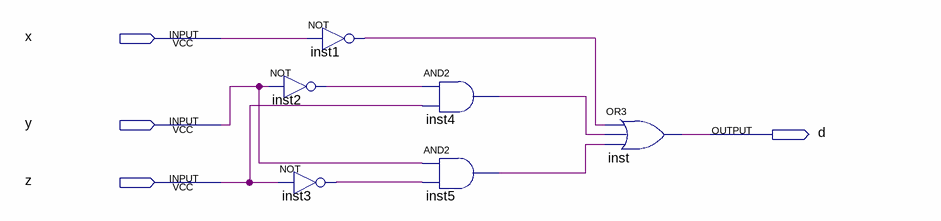
[diagram p0: schematic sheet]
// Quartus schematic Circuito-D.bdf as structural Verilog: 6 symbols, 4 pins
module \Circuito-D  (
  input  x,
  input  y,
  input  z,
  output d
);

  wire inst1_out, inst2_out, inst3_out, inst4_out, inst5_out;

  not inst2 (inst2_out, y);
  not inst1 (inst1_out, x);
  not inst3 (inst3_out, z);
  and inst4 (inst4_out, inst2_out, z);
  and inst5 (inst5_out, y, inst3_out);
  or inst (d, inst1_out, inst4_out, inst5_out);
endmodule
